# EAGLE design Skaarhoj BI8-2x4 (EAGLE 6.2)
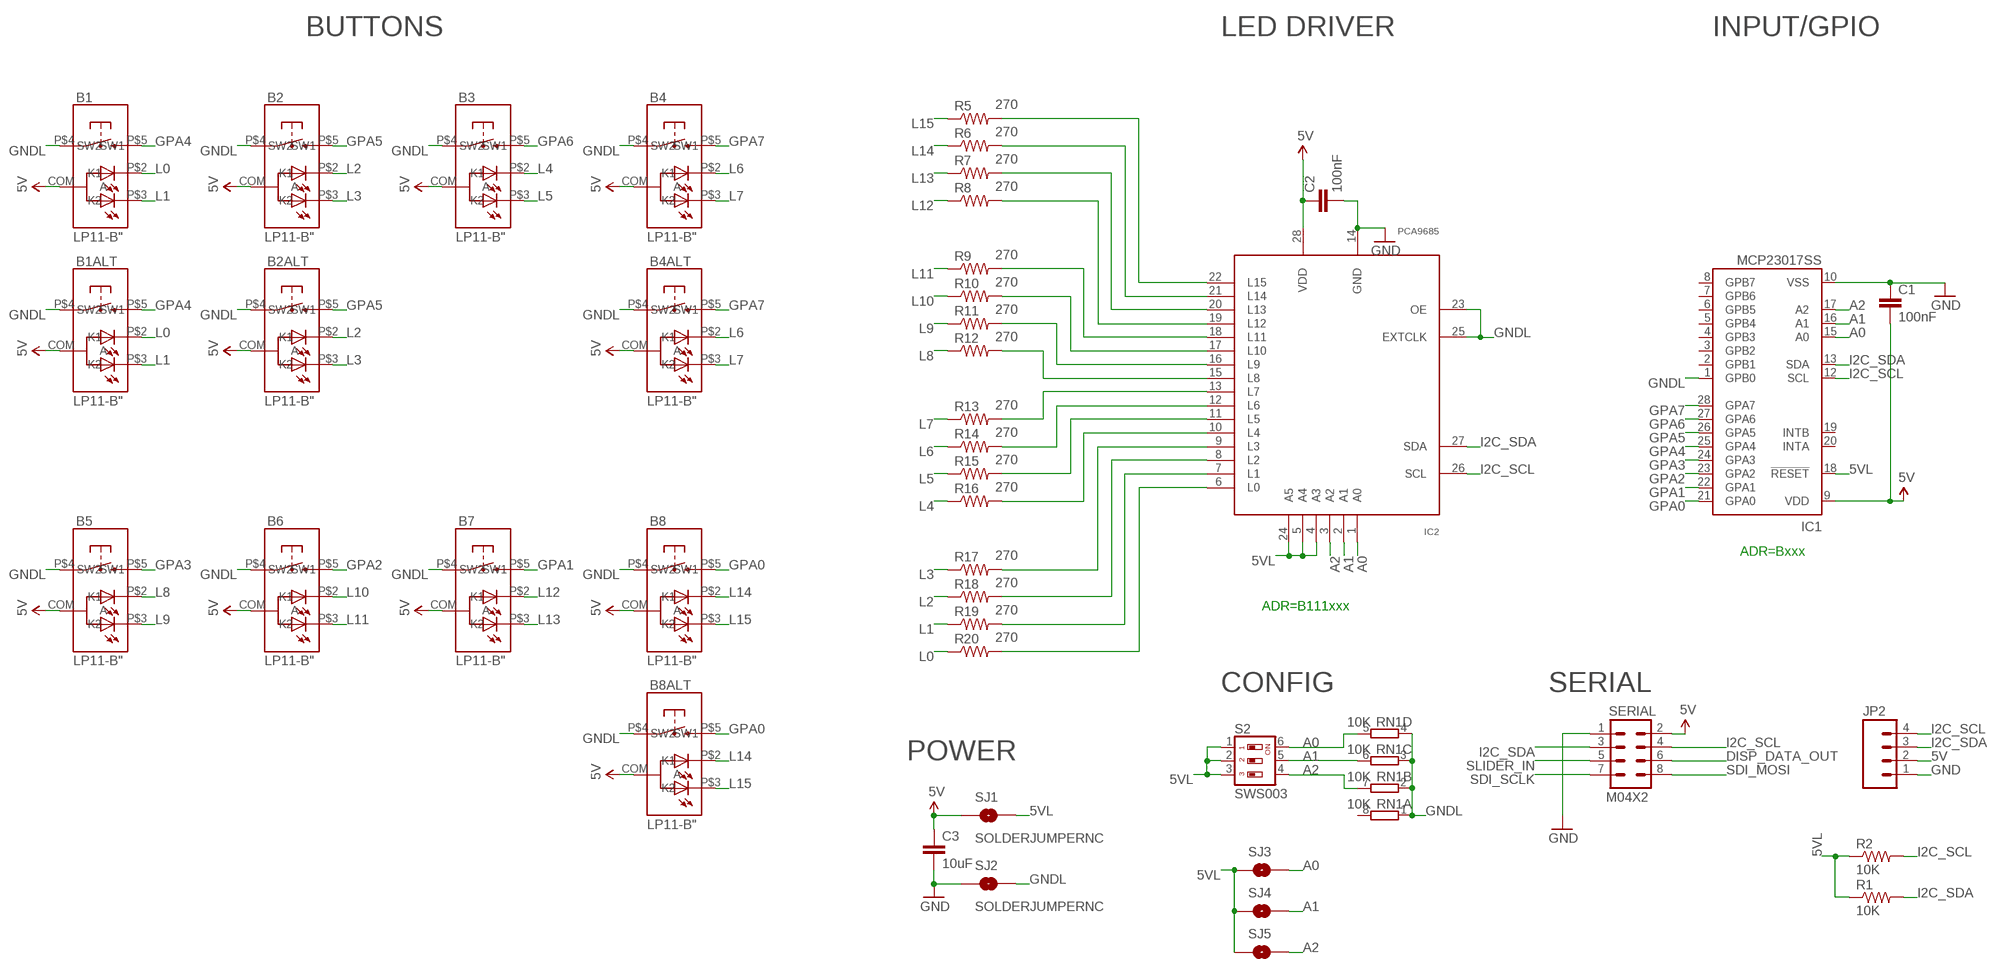
[diagram p0: schematic, sheet 1]

## Parts
B1  LP11-B"  [LP11]
B1ALT  LP11-B"  [LP11]
B2  LP11-B"  [LP11]
B2ALT  LP11-B"  [LP11]
B3  LP11-B"  [LP11]
B4  LP11-B"  [LP11]
B4ALT  LP11-B"  [LP11]
B5  LP11-B"  [LP11]
B6  LP11-B"  [LP11]
B7  LP11-B"  [LP11]
B8  LP11-B"  [LP11]
B8ALT  LP11-B"  [LP11]
C1  100nF  CAP0603-CAP  [0603-CAP]
C2  100nF  CAP0603-CAP  [0603-CAP]
C3  10uF  CAP0805  [0805]
IC1  MCP23017SS  [SSOP28]
IC2  PCA9685  [TSSOP28]
JP2  M04PTH  [1X04]
R1  10K  RESISTOR0603-RES  [0603-RES]
R2  10K  RESISTOR0603-RES  [0603-RES]
R5  270  RESISTOR0603-RES  [0603-RES]
R6  270  RESISTOR0603-RES  [0603-RES]
R7  270  RESISTOR0603-RES  [0603-RES]
R8  270  RESISTOR0603-RES  [0603-RES]
R9  270  RESISTOR0603-RES  [0603-RES]
R10  270  RESISTOR0603-RES  [0603-RES]
R11  270  RESISTOR0603-RES  [0603-RES]
R12  270  RESISTOR0603-RES  [0603-RES]
R13  270  RESISTOR0603-RES  [0603-RES]
R14  270  RESISTOR0603-RES  [0603-RES]
R15  270  RESISTOR0603-RES  [0603-RES]
R16  270  RESISTOR0603-RES  [0603-RES]
R17  270  RESISTOR0603-RES  [0603-RES]
R18  270  RESISTOR0603-RES  [0603-RES]
R19  270  RESISTOR0603-RES  [0603-RES]
R20  270  RESISTOR0603-RES  [0603-RES]
RN1  10K  4R-NCAY16  [CAY16_HAND]
S2  SWS003  [SMS-003]
SERIAL  M04X2  [2X4]
SJ1  SOLDERJUMPERNC  [SJ_2S]
SJ2  SOLDERJUMPERNC  [SJ_2S]
SJ3  SOLDERJUMPERNC  [SJ_2S]
SJ4  SOLDERJUMPERNC  [SJ_2S]
SJ5  SOLDERJUMPERNC  [SJ_2S]

## Nets
5V [Power]: B1.COM(A) B1ALT.COM(A) B2.COM(A) B2ALT.COM(A) B3.COM(A) B4.COM(A) B4ALT.COM(A) B5.COM(A) B6.COM(A) B7.COM(A) B8.COM(A) B8ALT.COM(A) C1.2 C2.1 C3.1 IC1.9(VDD) IC2.28(VDD) JP2.2 SERIAL.2 SJ1.1
5VL: IC1.18(!RESET) IC2.4(A3) IC2.5(A4) IC2.24(A5) R1.1 R2.1 S2.1 S2.2 S2.3 SJ1.2 SJ3.1 SJ4.1 SJ5.1
A0: IC1.15(A0) IC2.1(A0) RN1.5 S2.6 SJ3.2
A1: IC1.16(A1) IC2.2(A1) RN1.6 S2.5 SJ4.2
A2: IC1.17(A2) IC2.3(A2) RN1.7 S2.4 SJ5.2
DISP_DATA_OUT: SERIAL.6
GND [Power]: C1.1 C2.2 C3.2 IC1.10(VSS) IC2.14(GND) JP2.1 SERIAL.1 SJ2.1
GNDL: B1.P$4(SW1) B1ALT.P$4(SW1) B2.P$4(SW1) B2ALT.P$4(SW1) B3.P$4(SW1) B4.P$4(SW1) B4ALT.P$4(SW1) B5.P$4(SW1) B6.P$4(SW1) B7.P$4(SW1) B8.P$4(SW1) B8ALT.P$4(SW1) IC1.1(GPB0) IC2.23(OE) IC2.25(EXTCLK) RN1.1 RN1.2 RN1.3 RN1.4 SJ2.2
GPA0: B8.P$5(SW2) B8ALT.P$5(SW2) IC1.21(GPA0)
GPA1: B7.P$5(SW2) IC1.22(GPA1)
GPA2: B6.P$5(SW2) IC1.23(GPA2)
GPA3: B5.P$5(SW2) IC1.24(GPA3)
GPA4: B1.P$5(SW2) B1ALT.P$5(SW2) IC1.25(GPA4)
GPA5: B2.P$5(SW2) B2ALT.P$5(SW2) IC1.26(GPA5)
GPA6: B3.P$5(SW2) IC1.27(GPA6)
GPA7: B4.P$5(SW2) B4ALT.P$5(SW2) IC1.28(GPA7)
I2C_SCL: IC1.12(SCL) IC2.26(SCL) JP2.4 R2.2 SERIAL.4
I2C_SDA: IC1.13(SDA) IC2.27(SDA) JP2.3 R1.2 SERIAL.3
L0: B1.P$2(K1) B1ALT.P$2(K1) R20.1
L1: B1.P$3(K2) B1ALT.P$3(K2) R19.1
L2: B2.P$2(K1) B2ALT.P$2(K1) R18.1
L3: B2.P$3(K2) B2ALT.P$3(K2) R17.1
L4: B3.P$2(K1) R16.1
L5: B3.P$3(K2) R15.1
L6: B4.P$2(K1) B4ALT.P$2(K1) R14.1
L7: B4.P$3(K2) B4ALT.P$3(K2) R13.1
L8: B5.P$2(K1) R12.1
L9: B5.P$3(K2) R11.1
L10: B6.P$2(K1) R10.1
L11: B6.P$3(K2) R9.1
L12: B7.P$2(K1) R8.1
L13: B7.P$3(K2) R7.1
L14: B8.P$2(K1) B8ALT.P$2(K1) R6.1
L15: B8.P$3(K2) B8ALT.P$3(K2) R5.1
N$4: IC2.13(L7) R13.2
N$5: IC2.12(L6) R14.2
N$7: IC2.11(L5) R15.2
N$9: IC2.10(L4) R16.2
N$10: IC2.9(L3) R17.2
N$11: IC2.8(L2) R18.2
N$12: IC2.7(L1) R19.2
N$19: IC2.6(L0) R20.2
N$20: IC2.15(L8) R12.2
N$21: IC2.16(L9) R11.2
N$22: IC2.17(L10) R10.2
N$23: IC2.18(L11) R9.2
N$24: IC2.19(L12) R8.2
N$25: IC2.20(L13) R7.2
N$26: IC2.21(L14) R6.2
N$27: IC2.22(L15) R5.2
SDI_MOSI: SERIAL.8
SDI_SCLK: SERIAL.7
SLIDER_IN: SERIAL.5
Unconnected: IC1.2(GPB1) IC1.3(GPB2) IC1.4(GPB3) IC1.5(GPB4) IC1.6(GPB5) IC1.7(GPB6) IC1.8(GPB7) IC1.19(INTB) IC1.20(INTA) RN1.8

## Notes on the sheet
- BUTTONS | LED DRIVER | INPUT/GPIO
- ADR=Bxxx
- ADR=B111xxx
- CONFIG | SERIAL
- POWER

## Library data of the parts
B1 B1ALT B2 B2ALT B3 B4 B4ALT B5-B8 B8ALT = SKAARHOJ:LP11-B
C1-C3 = SparkFun:CAP: Capacitor Standard 0603 ceramic capacitor, and 0.1" leaded capacitor.
IC1 = microchip:MCP23017: http://ww1.microchip.com/downloads/en/DeviceDoc/21952a.pdf Source: http://ww1.microchip.com/downloads/en/DeviceDoc/21952a.pdf; MF: MICROCHIP; MPN: MCP23017-E/SS; OC_FARNELL: 1467674; OC_NEWARK: 31K2960
IC2 = wsmith:PCA9685
JP2 = SparkFun:M04: Header 4 Standard 4-pin 0.1" header. Use with straight break away headers (SKU : PRT-00116), right angle break away headers (PRT-00553), swiss pins (PRT-00743), machine pins (PRT-00117), and female headers (PRT-00115). Molex polarized connector foot print use with SKU : PRT-08231 with associated crimp pins and housings. 1MM SMD Version SKU: PRT-10208
R1 R2 R5-R20 = SparkFun:RESISTOR: Resistor Basic schematic elements and footprints for 0603, 1206, and PTH resistors.
RN1 = SKAARHOJ:4R-N: Array Chip Resistor Source: RS Component / Phycomp; OC_FARNELL: unknown; OC_NEWARK: unknown
S2 = smd-special:SWS003: SMD Dip Switch 3 pol.
SERIAL = SparkFun:M04X2
SJ1-SJ5 = SparkFun:SOLDERJUMPER: Solder Jumper Standard SMD solder jumper. Used to automate production. Two varients : Normally Open and Normally Closed are the same, but have different paste layers. NC will have a large amount of paste and should jumper during reflow.

## Net classes
0 default: width 0.203 mm, drill 0.406 mm, clearance 0.203 mm
1 Power: width 0.406 mm, drill 0.61 mm, clearance 0.203 mm

## Board
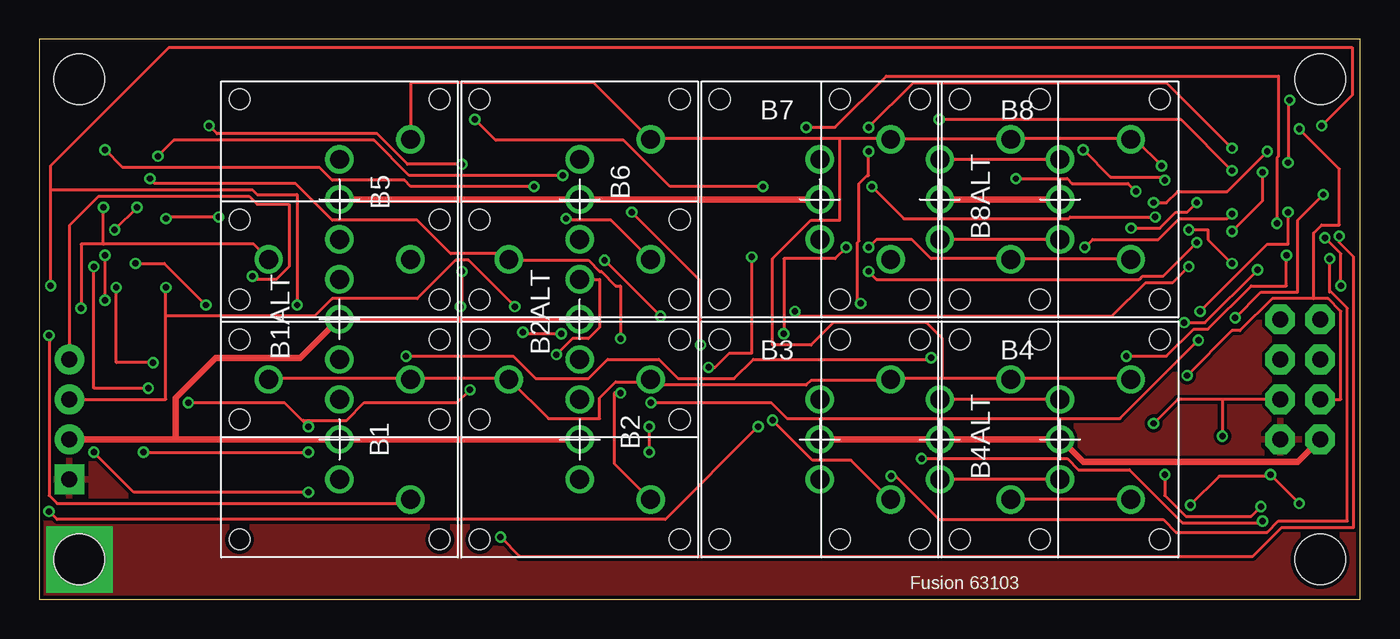
[diagram p1: board, top side]
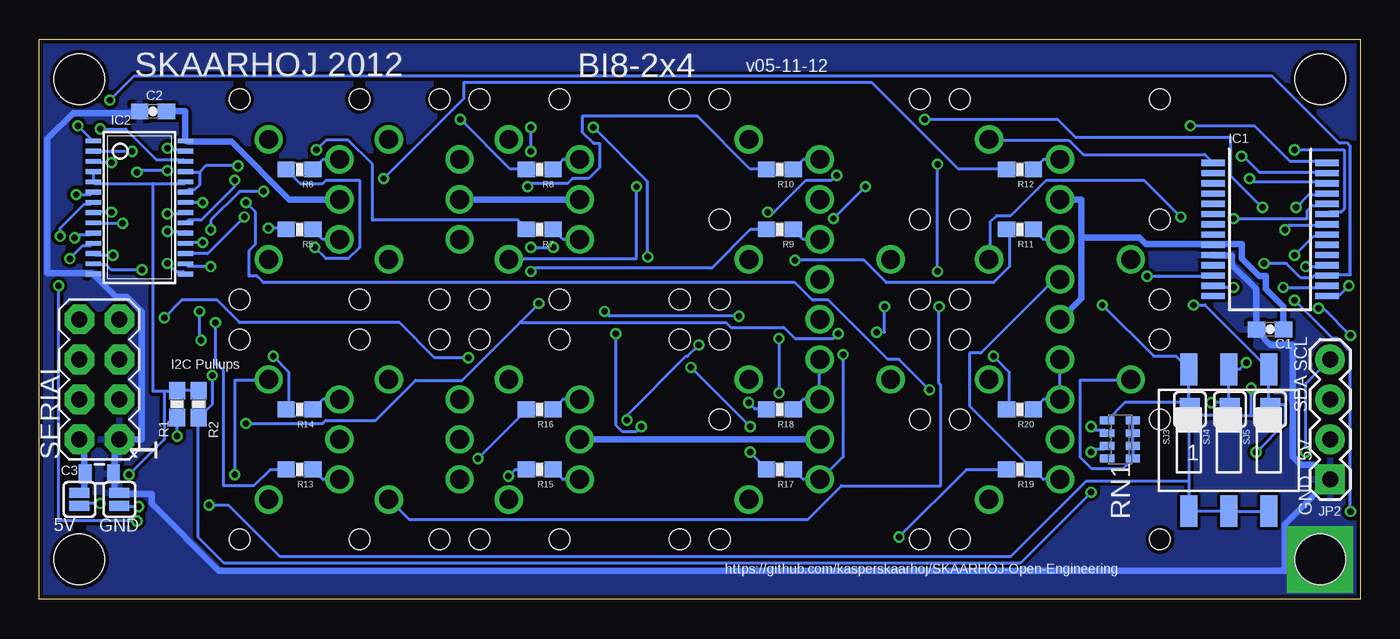
[diagram p2: board, bottom side, seen from below]

Size 83.82 x 35.56 mm. Coordinates in mm from the lower left corner, seen from the top.
Outline: 0,0 83.82,0 83.82,35.56 0,35.56 0,0
Copper layers (1*16): Top 0.035mm / dielectric 1.5mm / Bottom 0.035mm
Design rules: minimum track width 6mil, minimum drill 12mil, track to track 6mil, track to pad 6mil, pad to pad 6mil, via to via 6mil, smd to smd 0mil, copper to edge 10mil, drill to drill 10mil, minimum pad ring 10mil, minimum via ring 6mil, stop-mask expansion 2mil, vias tented up to drill 100mil, thermal gap 10mil
Holes 3.2 mm at 2.54,33.02 2.54,2.54 81.28,2.54 81.28,33.02

### Footprints (pad centres in the part's own frame; a part is rotated, then mirrored left to right if it is on the bottom)
LP11 = drill 1.2: COM 0,0; P$2 0,2.54; P$3 0,-2.54; P$4 4.5,3.81; P$5 4.5,-3.81 | hole 1.3: -6.35,6.35; 6.35,6.35; 6.35,-6.35; -6.35,-6.35
0603-CAP = smd 1.1 x 1: 1 -0.85,0; 2 0.85,0
0805 = smd 0.8 x 1.2: 1 -0.9,0; 2 0.9,0
SSOP28 = smd 0.4 x 1.5: 1 -4.225,-3.625; 2 -3.575,-3.625; 3 -2.925,-3.625; 4 -2.275,-3.625; 5 -1.625,-3.625; 6 -0.975,-3.625; 7 -0.325,-3.625; 8 0.325,-3.625; 9 0.975,-3.625; 10 1.625,-3.625; 11 2.275,-3.625; 12 2.925,-3.625; 13 3.575,-3.625; 14 4.225,-3.625; 15 4.225,3.625; 16 3.575,3.625; 17 2.925,3.625; 18 2.275,3.625; 19 1.625,3.625; 20 0.975,3.625; 21 0.325,3.625; 22 -0.325,3.625; 23 -0.975,3.625; 24 -1.625,3.625; 25 -2.275,3.625; 26 -2.925,3.625; 27 -3.575,3.625; 28 -4.225,3.625
TSSOP28 = smd 0.305 x 0.991: 1 -4.225,-2.918; 2 -3.575,-2.918; 3 -2.925,-2.918; 4 -2.275,-2.918; 5 -1.625,-2.918; 6 -0.975,-2.918; 7 -0.325,-2.918; 8 0.325,-2.918; 9 0.975,-2.918; 10 1.625,-2.918; 11 2.275,-2.918; 12 2.925,-2.918; 13 3.575,-2.918; 14 4.225,-2.918; 15 4.225,2.918; 16 3.575,2.918; 17 2.925,2.918; 18 2.275,2.918; 19 1.625,2.918; 20 0.975,2.918; 21 0.325,2.918; 22 -0.325,2.918; 23 -0.975,2.918; 24 -1.625,2.918; 25 -2.275,2.918; 26 -2.925,2.918; 27 -3.575,2.918; 28 -4.225,2.918
1X04 = drill 1.016 pad 1.88 square: 1 0,0 | drill 1.016 pad 1.88: 2 2.54,0; 3 5.08,0; 4 7.62,0
0603-RES = smd 1.1 x 1: 1 -0.85,0; 2 0.85,0
CAY16_HAND = smd 0.5 x 0.904: 1 -1.2,-0.813; 2 -0.4,-0.813; 3 0.4,-0.813; 4 1.2,-0.813; 5 1.2,0.813; 6 0.4,0.813; 7 -0.4,0.813; 8 -1.2,0.813
SMS-003 = smd 1.092 x 2.007: 1 -2.54,-4.496; 2 0,-4.496; 3 2.54,-4.496; 4 2.54,4.496; 5 0,4.496; 6 -2.54,4.496
2X4 = drill 1.016 pad 1.88 octagon: 1 -3.81,-1.27; 2 -3.81,1.27; 3 -1.27,-1.27; 4 -1.27,1.27; 5 1.27,-1.27; 6 1.27,1.27; 7 3.81,-1.27; 8 3.81,1.27
SJ_2S = smd 0.635 x 1.27: 1 -0.412,0; 2 0.412,0

### Placement (x,y rotation side)
B1  19.05,10.16 0 top
B1ALT  19.05,17.78 180 top
B2  34.29,10.16 0 top
B2ALT  34.29,17.78 180 top
B3  49.53,10.16 0 top
B4  64.77,10.16 0 top
B4ALT  57.15,10.16 0 top
B5  19.05,25.4 0 top
B6  34.29,25.4 0 top
B7  49.53,25.4 0 top
B8  64.77,25.4 0 top
B8ALT  57.15,25.4 0 top
C1  5.71,17.14 0 bottom
C2  76.61,30.99 180 bottom
C3  80.01,7.98 0 bottom
IC1  5.71,23.5 270 bottom
IC2  77.47,24.89 270 bottom
JP2  1.91,7.62 90 bottom
R1  75.08,12.4 270 bottom
R2  73.71,12.4 270 bottom
R5  67.31,23.5 180 bottom
R6  67.31,27.3 180 bottom
R7  52.07,23.5 180 bottom
R8  52.07,27.3 180 bottom
R9  36.83,23.5 180 bottom
R10  36.83,27.3 180 bottom
R11  21.59,23.5 180 bottom
R12  21.59,27.3 180 bottom
R13  67.31,8.26 180 bottom
R14  67.31,12.06 180 bottom
R15  52.07,8.26 180 bottom
R16  52.07,12.06 180 bottom
R17  36.83,8.26 180 bottom
R18  36.83,12.06 180 bottom
R19  21.59,8.26 180 bottom
R20  21.59,12.06 180 bottom
RN1  15.24,10.16 90 bottom
S2  8.33,10.11 0 bottom
SERIAL  80.01,13.97 90 bottom
SJ1  81.28,6.35 270 bottom
SJ2  78.74,6.35 270 bottom
SJ3  10.79,12.06 90 bottom
SJ4  8.26,12.06 90 bottom
SJ5  5.71,12.06 90 bottom

### Tracks (layer width: path | path; a pad name or v marks a point on that pad's centre or on a via)
5V
  Top 0.406: B2ALT.COM B1ALT.COM 18.9,17.68 16.56,15.34 11.18,15.34 8.64,12.8 8.64,10.16 | B7.COM B6.COM B5.COM | B8.COM B8ALT.COM | B2.COM B1.COM 8.64,10.16 | 8.64,10.16 JP2.2 | B3.COM B4ALT.COM B4.COM 64.92,10.06 66.24,8.74 79.86,8.74 SERIAL.2
  Bottom 0.406: C1.2 4.88,17.17 4.88,18.59 5.99,19.71 5.99,20.52 6.4,20.52 7.52,21.64 7.52,22.55 9.25,22.55 IC1.9 9.45,22.55 13.61,22.55 14.02,22.96 17.68,22.96 | 17.68,22.96 17.68,25.4 B5.COM | 17.68,22.96 17.68,19.1 19,17.78 B1ALT.COM | C2.1 74.57,30.99 74.57,29.16 IC2.28 74.37,29.06 71.63,29.06 67.97,25.4 B8.COM | B8ALT.COM B7.COM | SJ1.1 81.28,6.81 80.97,6.81 80.97,7.92 C3.1 80.97,8.13 80.97,10.16 SERIAL.2 | B3.COM B2.COM
5VL  (via drill 0.41)
  Top 0.203: v3.45,21.13 3.45,13.41 v6.91,13.41 | v79.96,6.1 v78.13,7.92 78.13,7.82 74.88,7.82 v73.05,5.99
  Bottom 0.203: 8.33,5.59 5.79,5.59 S2.3 | 8.33,5.59 10.87,5.59 S2.1 10.87,7.52 | 8.33,5.59 S2.2 | 6.91,11.68 8.23,11.68 SJ4.1 8.33,11.68 10.77,11.68 SJ3.1 10.87,11.58 10.87,7.52 | 6.91,11.68 5.79,11.68 SJ5.1 | v3.45,21.13 2.13,21.13 IC1.18 | 6.91,11.68 v6.91,13.41 | 76.61,26.42 80.37,26.42 IC2.5 80.37,26.62 80.37,27.13 IC2.4 | 76.61,26.42 74.57,26.42 IC2.24 | R2.1 73.76,13.31 75.08,13.31 R1.1 75.08,13.21 75.89,13.21 | v79.96,6.1 81.18,6.1 81.28,5.99 SJ1.2 | v78.13,7.92 75.89,10.16 75.89,13.21 | 76.61,26.42 76.61,13.21 75.89,13.21 | 10.87,7.52 17.37,7.52 22.15,2.74 68.58,2.74 71.83,5.99 v73.05,5.99
A0  (via drill 0.41)
  Top 0.203: v81.38,30.07 83.31,32 83.31,35.05 8.23,35.05 0.71,27.53 0.71,26.01 | v0.71,19.91 0.71,26.01 | v16.36,18.69 16.36,25.7 13.82,25.7 13.51,26.01 0.71,26.01
  Bottom 0.203: RN1.5 16.05,11.38 14.94,12.5 10.87,12.5 SJ3.2 10.87,12.6 S2.6 10.87,14.63 11.68,15.44 13.11,15.44 v16.36,18.69 | v81.38,30.07 80.47,29.16 IC2.1 | v0.71,19.91 1.32,19.3 2.03,19.3 IC1.15
A1  (via drill 0.41)
  Top 0.203: v4.88,19.81 4.88,15.04 v7.21,15.04 | 16.71,11.33 15.54,12.5 v9.45,12.5 | 16.71,11.33 v17.07,10.97 | v77.93,28.45 75.39,25.91 72.24,25.91 71.53,25.2 v70.71,25.2 | v27.33,13.31 26.52,12.5 20.62,12.5 19.51,11.38 16.76,11.38 16.71,11.33
  Bottom 0.203: v4.88,19.81 2.23,19.81 2.13,19.91 IC1.16 | v7.21,15.04 7.62,14.63 8.33,14.63 S2.5 8.33,12.6 SJ4.2 8.33,12.5 v9.45,12.5 | v17.07,10.97 16.87,10.77 16.26,10.77 RN1.6 | v77.93,28.45 80.37,28.45 IC2.2 | v70.71,25.2 70.1,24.59 70.1,22.55 70.51,22.15 70.51,20.52 70,20.52 69.6,20.12 35.87,20.12 34.75,19 33.73,19 29.97,15.24 29.26,15.24 v27.33,13.31
A2  (via drill 0.41)
  Top 0.203: v6.6,9.35 v17.07,9.35 | v79.25,27.74 79.25,31.7 v79.35,31.7 | v10.57,18.69 7.92,21.34 v6.1,21.34
  Bottom 0.203: v17.07,9.35 16.87,9.55 16.26,9.55 RN1.7 | v6.6,9.35 4.78,11.18 4.78,12.39 5.69,12.39 SJ5.2 5.79,12.5 S2.4 5.79,14.63 9.86,18.69 v10.57,18.69 | v79.25,27.74 80.37,27.74 IC2.3 | v79.35,31.7 77.83,33.22 5.59,33.22 1.32,28.96 0.81,28.96 0.61,28.75 0.61,20.62 2.03,20.62 IC1.17 2.13,20.52 2.95,20.52 3.05,20.42 3.76,20.42 4.67,21.34 v6.1,21.34
GND  (via drill 3.2)
  Bottom 0.406: IC1.10 9.25,21.84 8.13,21.84 8.13,21.23 6.6,19.71 6.6,17.17 C1.1 6.5,16.97 5.69,16.15 4.27,16.15 4.27,9.04 3.76,8.53 2.85,8.53 1.93,7.62 JP2.1 2.03,7.52 4.78,4.78 4.78,1.83 | C2.2 77.52,30.99 77.62,30.89 81.69,30.89 83.31,29.26 83.31,20.73 80.57,20.73 IC2.14 80.37,20.62 78.94,19.2 78.23,19.2 77.32,18.29 77.32,10.16 SERIAL.1 78.84,10.06 79.05,10.06 79.05,8.13 C3.2 79.05,7.92 79.05,6.81 78.74,6.81 SJ2.1 78.64,6.71 76.71,6.71 76.71,6.1 72.44,1.83 4.78,1.83 | 4.78,1.83 2.54,1.83 v2.54,2.54
  pour Top: 0,0 83.82,0 83.82,35.56 0,35.56
  pour Bottom: 0,0 83.82,0 83.82,35.56 0,35.56
GNDL  (via drill 0.41)
  Top 0.203: v71.22,27.53 69.6,29.16 69.29,29.16 B8.P$4 69.19,29.26 61.67,29.26 B8ALT.P$4 61.57,29.26 54.05,29.26 B7.P$4 53.95,29.26 50.8,29.26 | 50.8,29.26 38.81,29.26 B6.P$4 38.71,29.26 35.15,32.82 23.57,32.82 23.57,29.26 B5.P$4 | B1ALT.P$4 14.63,14.02 23.47,14.02 B1.P$4 23.57,14.02 29.77,14.02 B2ALT.P$4 29.87,13.92 32.31,11.48 35.56,11.48 35.56,12.8 36.58,13.82 38.61,13.82 38.71,13.92 B2.P$4 38.81,13.92 39.12,13.61 48.67,13.61 48.97,13.92 53.95,13.92 B3.P$4 54.05,14.02 57.3,14.02 | 57.3,14.02 61.57,14.02 B4ALT.P$4 61.67,14.02 69.19,14.02 B4.P$4 | v77.52,5.89 76.91,5.28 72.75,5.28 71.42,6.6 v71.42,7.92 | 50.8,29.26 50.8,24.08 48.97,24.08 46.53,21.64 46.53,16.15 48.97,16.15 50.39,17.58 56.29,17.58 57.3,16.56 57.3,14.02
  Bottom 0.203: IC1.1 9.35,27.74 9.86,28.25 17.58,28.25 18.49,29.16 23.47,29.16 B5.P$4 | 73.66,27.13 73.66,26.31 73.97,26.01 74.37,26.01 74.47,25.91 IC2.23 | 73.66,27.13 74.47,27.13 IC2.25 | 73.66,27.13 73.25,27.53 v71.22,27.53 | RN1.4 RN1.3 RN1.2 RN1.1 14.43,8.94 15.04,8.33 17.07,8.33 17.78,9.04 17.78,13.92 14.63,13.92 B1ALT.P$4 | v77.52,5.89 78.74,5.89 SJ2.2 | v71.42,7.92 71.42,13.92 69.29,13.92 B4.P$4
GPA0  (via drill 0.41)
  Top 0.203: v4.17,19 v4.17,21.84 | v0.61,5.59 1.12,5.08 39.73,5.08 v45.62,10.97 | v47.24,16.87 47.24,21.64 50.49,21.64 v51.21,22.35 | v52.63,22.35 53.14,22.86 55.37,22.86 56.59,21.64 61.57,21.64 B8ALT.P$5 61.67,21.64 69.19,21.64 B8.P$5
  Bottom 0.203: v4.17,21.84 2.95,23.06 2.23,23.06 2.13,23.16 IC1.21 | v4.17,19 1.73,16.56 1.42,16.56 0.61,15.75 v0.61,5.59 | v45.62,10.97 45.92,10.67 46.84,10.67 47.24,11.07 v47.24,16.87 | v52.63,22.35 v51.21,22.35
GPA1  (via drill 0.41)
  Top 0.203: v6.2,24.89 v4.78,23.47 | v27.64,30.48 28.96,29.16 37.08,29.16 40.03,26.21 v45.92,26.21
  Bottom 0.203: v4.78,23.47 4.47,23.77 2.13,23.77 IC1.22 | v6.2,24.89 8.23,26.92 8.23,29.36 18.09,29.36 19.2,30.48 v27.64,30.48 | v45.92,26.21 45.92,21.64 53.95,21.64 B7.P$5
GPA2  (via drill 0.41)
  Top 0.203: v4.17,28.55 5.28,27.43 17.78,27.43 18.59,26.62 23.16,26.62 23.57,26.21 v31.39,26.21 | v33.43,24.18 33.53,24.08 36.27,24.08 38.71,21.64 B6.P$5
  Bottom 0.203: v4.17,28.55 1.02,28.55 1.02,24.79 1.22,24.59 1.93,24.59 2.03,24.49 IC1.23 | v33.43,24.18 v31.39,26.21
GPA3  (via drill 0.41)
  Top 0.203: v8.03,24.18 8.13,24.28 v11.38,24.28
  Bottom 0.203: v8.03,24.18 3.35,24.18 3.35,24.69 3.05,24.99 2.23,24.99 2.13,25.09 IC1.24 | v11.38,24.28 13.72,26.62 19.91,26.62 22.15,24.38 23.06,24.38 23.47,23.98 23.47,21.64 B5.P$5
GPA4  (via drill 0.41)
  Top 0.203: 4.06,22.55 v4.06,24.89 | 4.06,22.55 13.61,22.55 14.53,21.64 B1ALT.P$5 | v0.61,16.76 0.61,6.6 1.12,6.1 23.27,6.1 23.47,6.3 B1.P$5 | v2.64,18.49 2.64,22.55 4.06,22.55
  Bottom 0.203: v4.06,24.89 3.25,25.7 2.13,25.7 IC1.25 | v0.61,16.76 2.34,18.49 v2.64,18.49
GPA5  (via drill 0.41)
  Top 0.203: v7.01,26.72 7.32,26.42 16.26,26.42 18.59,24.08 23.98,24.08 26.11,21.95 29.46,21.95 29.77,21.64 B2ALT.P$5 29.87,21.54 34.85,21.54 35.56,20.83 35.66,20.83 36.58,19.91 36.88,19.91 v36.88,16.56 | v36.88,13.11 36.47,13.11 36.47,8.64 38.71,6.4 B2.P$5
  Bottom 0.203: v7.01,26.72 6.81,26.52 2.13,26.52 IC1.26 | v36.88,16.56 v36.88,13.11
GPA6  (via drill 0.41)
  Top 0.203: v7.52,28.14 8.53,29.16 21.23,29.16 23.47,26.92 v33.22,26.92 | v37.59,24.59 41.96,20.22 v41.96,16.15 | v46.53,11.38 49.07,8.84 51.51,8.84 53.95,6.4 B3.P$5
  Bottom 0.203: v7.52,28.14 7.42,28.14 6.4,27.13 2.13,27.13 IC1.27 | v33.22,26.92 33.53,26.62 35.15,26.62 37.19,24.59 v37.59,24.59 | v41.96,16.15 42.67,15.44 42.77,15.44 46.53,11.68 v46.53,11.38
GPA7  (via drill 0.41)
  Top 0.203: v10.77,30.07 11.28,29.57 21.44,29.57 23.37,27.64 v26.82,27.64 | v26.82,20.83 26.82,18.59 v26.72,18.59 | B4.P$5 69.19,6.4 61.67,6.4 B4ALT.P$5
  Bottom 0.203: v10.77,30.07 6.71,30.07 4.47,27.84 2.23,27.84 2.13,27.74 IC1.28 | v26.82,20.83 v26.82,27.64 | v26.72,18.59 26.72,13.72 26.62,13.61 26.62,7.21 32.92,7.21 35.05,5.08 60.35,5.08 61.57,6.3 B4ALT.P$5
I2C_SCL  (via drill 0.41)
  Top 0.203: v13.51,20.52 13.72,20.32 15.04,20.32 15.85,21.13 15.85,25.09 13.82,25.09 13.31,25.6 3.76,25.6 1.93,23.77 1.93,15.24 JP2.4 | v79.96,29.87 82.5,27.33 82.5,23.77 81.38,23.77 80.87,23.27 80.87,19.1 | 80.87,19.1 81.79,19.1 82.6,18.29 82.6,12.7 SERIAL.4 | v72.85,14.22 75.69,17.07 76.2,17.07 78.23,19.1 80.87,19.1 | v3.45,9.35 5.99,6.81 v17.07,6.81
  Bottom 0.203: v13.51,20.52 9.35,20.52 IC1.12 | v79.96,29.87 78.33,29.87 76.4,27.94 74.68,27.94 74.57,27.84 IC2.26 | v72.85,14.22 72.85,12.39 73.66,11.58 R2.2 73.76,11.48 73.76,3.96 72.14,2.34 21.54,2.34 v17.07,6.81 | v3.45,9.35 3.45,13.72 1.93,15.24 JP2.4
I2C_SDA  (via drill 0.41)
  Top 0.203: 8.03,17.98 8.03,12.7 JP2.3 | 8.03,17.98 v8.03,19.81 | v75.69,28.65 71.53,32.82 55.47,32.82 v52.63,29.97 | v52.63,28.45 52.63,26.92 52.53,26.92 52.02,26.42 52.02,22.76 51.92,22.66 51.92,18.8 v52.12,18.8 | v70.71,11.18 72.24,12.7 75.08,12.7 | SERIAL.3 75.08,12.7 | 75.08,12.7 v75.08,10.36 | 8.03,17.98 17.48,17.98 18.59,19.1 23.98,19.1 26.42,21.54 27.23,21.54 v30.18,18.59 | v30.68,16.97 30.79,16.87 v33.12,16.87
  Bottom 0.203: v8.03,19.81 9.14,19.81 9.25,19.91 IC1.13 | v75.69,28.65 75.59,28.55 74.57,28.55 IC2.27 | v52.63,28.45 v52.63,29.97 | 53.29,17.63 57,13.92 59.94,13.92 62.48,11.38 65.63,11.38 65.84,11.18 v70.71,11.18 | 53.29,17.63 v52.12,18.8 | v75.08,10.36 R1.2 | v30.18,18.59 30.18,16.97 v30.68,16.97 | v33.12,16.87 33.43,16.56 35.87,16.56 36.58,17.27 39.93,17.27 40.23,17.58 53.24,17.58 53.29,17.63
L0
  Bottom 0.203: 19.1,12.7 20.12,12.7 20.73,12.09 R20.1 | 19.1,12.7 19.1,15.24 B1ALT.P$2 | 19.1,12.7 B1.P$2
L1
  Bottom 0.203: B1.P$3 20.12,7.62 20.73,8.23 R19.1 20.83,8.33 24.79,12.29 24.79,15.65 24.08,15.65 19.41,20.32 B1ALT.P$3
L2
  Bottom 0.203: 34.34,12.7 35.36,12.7 35.97,12.09 R18.1 | 34.34,12.7 34.34,15.24 B2ALT.P$2 | 34.34,12.7 B2.P$2
L3  (via drill 0.41)
  Top 0.203: v32.82,15.54 33.83,16.56 34.85,16.56 35.56,17.27 35.56,20.32 B2ALT.P$3
  Bottom 0.203: R17.1 35.97,8.23 35.36,7.62 B2.P$3 34.24,7.62 32.82,9.04 v32.82,15.54
L4
  Bottom 0.203: B3.P$2 50.6,12.7 51.21,12.09 R16.1
L5
  Bottom 0.203: B3.P$3 50.6,7.62 51.21,8.23 R15.1
L6
  Top 0.203: B4.P$2 B4ALT.P$2
  Bottom 0.203: B4.P$2 65.84,12.7 66.45,12.09 R14.1
L7
  Top 0.203: B4.P$3 B4ALT.P$3
  Bottom 0.203: B4.P$3 65.84,7.62 66.45,8.23 R13.1
L8
  Bottom 0.203: B5.P$2 20.12,27.94 20.73,27.33 R12.1
L9
  Bottom 0.203: B5.P$3 20.12,22.86 20.73,23.47 R11.1
L10
  Bottom 0.203: B6.P$2 35.36,27.94 35.97,27.33 R10.1
L11
  Bottom 0.203: B6.P$3 35.36,22.86 35.97,23.47 R9.1
L12
  Bottom 0.203: B7.P$2 50.6,27.94 51.21,27.33 R8.1
L13
  Bottom 0.203: B7.P$3 50.6,22.86 51.21,23.47 R7.1
L14
  Top 0.203: B8.P$2 B8ALT.P$2
  Bottom 0.203: B8.P$2 65.84,27.94 66.45,27.33 R6.1
L15
  Top 0.203: B8.P$3 B8ALT.P$3
  Bottom 0.203: B8.P$3 65.84,22.86 66.45,23.47 R5.1
N$4  (via drill 0.41)
  Top 0.203: v77.32,20.93 73.97,17.58 v72.64,17.58
  Bottom 0.203: v77.32,20.93 79.25,20.93 79.55,21.23 80.37,21.23 IC2.13 | v72.64,17.58 72.64,14.94 72.54,14.94 72.14,14.53 72.14,7.21 70.21,7.21 69.19,8.23 68.17,8.23 R13.2
N$5  (via drill 0.41)
  Top 0.203: v79.15,21.84 79.15,19.91 76.91,19.91 74.17,17.17 73.25,17.17 71.53,15.44 v68.99,15.44
  Bottom 0.203: v79.15,21.84 80.26,21.84 80.37,21.95 IC2.12 | v68.99,15.44 67.97,14.43 67.97,12.09 68.07,12.09 R14.2
N$7  (via drill 0.41)
  Top 0.203: v81.89,21.64 81.89,19.51 81.99,19.51 83.01,18.49 83.01,4.98 78.64,4.98 77.93,4.27 72.14,4.27 71.32,5.08 57.1,5.08 54.36,7.82 v54.05,7.82
  Bottom 0.203: v81.89,21.64 81.08,22.45 80.57,22.45 80.47,22.55 IC2.11 | v54.05,7.82 53.65,8.23 52.93,8.23 R15.2
N$9  (via drill 0.41)
  Top 0.203: v81.58,22.96 82.6,21.95 v82.6,19.91 | v77.62,4.98 77.52,4.88 72.54,4.88 69.19,8.23 65.94,8.23 65.23,8.94 v55.98,8.94
  Bottom 0.203: v81.58,22.96 81.38,23.16 80.57,23.16 80.47,23.27 IC2.10 | v82.6,19.91 82.6,4.98 v77.62,4.98 | v55.98,8.94 52.93,11.99 R16.2
N$10  (via drill 0.41)
  Top 0.203: v78.54,23.88 78.54,28.04 78.64,28.14 78.64,33.22 53.75,33.22 50.49,29.97 v48.67,29.97 | v45.21,21.74 45.21,15.65 43.79,15.65 42.88,14.73 v42.47,14.73 | v38.71,9.35 v38.71,10.97
  Bottom 0.203: v78.54,23.88 80.37,23.88 IC2.9 | v48.67,29.97 45.21,26.52 v45.21,21.74 | v38.71,10.97 v42.47,14.73 | v38.71,9.35 37.69,8.33 R17.2
N$11  (via drill 0.41)
  Top 0.203: v79.25,24.59 79.25,22.55 77.93,22.55 v73.66,18.29 | v73.56,16.46 68.58,11.48 47.45,11.48 46.43,12.5 v38.81,12.5
  Bottom 0.203: v79.25,24.59 80.37,24.59 IC2.8 | v73.66,18.29 73.66,16.46 v73.56,16.46 | v38.81,12.5 38.41,12.09 37.69,12.09 R18.2
N$12  (via drill 0.41)
  Top 0.203: v82.5,23.06 82.5,22.66 83.41,21.74 83.41,4.57 78.84,4.57 77.01,2.74 30.48,2.74 v29.26,3.96
  Bottom 0.203: v82.5,23.06 82.5,23.57 80.97,25.09 80.57,25.09 80.47,25.2 IC2.7 | v29.26,3.96 24.99,8.23 22.45,8.23 R19.2
N$19  (via drill 0.41)
  Top 0.203: v81.48,25.7 79.86,24.08 79.86,19.51 77.52,19.51 v75.89,17.88 | v56.59,15.34 56.49,15.24 45.31,15.24 44.09,14.02 40.54,14.02 39.32,15.24 36.07,15.24 34.85,14.02 31.5,14.02 30.07,15.44 v23.27,15.44
  Bottom 0.203: v81.48,25.7 80.57,25.7 80.47,25.81 IC2.6 | v75.89,17.88 74.78,19 72.54,19 71.12,17.58 60.96,17.58 58.73,15.34 v56.59,15.34 | v23.27,15.44 22.25,14.43 22.25,12.09 22.35,12.09 R20.2
N$20  (via drill 0.41)
  Top 0.203: v75.69,21.34 74.17,22.86 74.17,23.47 v72.95,23.47 | v69.6,25.91 69.09,26.42 65.53,26.42 65.23,26.72 v61.98,26.72
  Bottom 0.203: v75.69,21.34 75.18,20.83 74.68,20.83 74.57,20.73 IC2.15 | v72.95,23.47 72.95,24.08 71.12,25.91 v69.6,25.91 | v61.98,26.72 56.9,31.8 56.9,32.82 30.99,32.82 25.5,27.33 22.45,27.33 R12.2
N$21  (via drill 0.41)
  Top 0.203: v72.95,21.13 71.93,20.12 70.21,20.12 68.07,17.98 48.26,17.98 v47.95,18.29 | v35.87,21.54 v39.42,17.98
  Bottom 0.203: v72.95,21.13 74.37,21.13 74.47,21.23 IC2.16 | v47.95,18.29 47.65,17.98 v39.42,17.98 | v35.87,21.54 31.5,21.54 30.07,20.12 23.27,20.12 22.25,21.13 22.25,23.47 22.35,23.47 R11.2
N$22  (via drill 0.41)
  Top 0.203: v70.81,24.28 65.43,24.28 65.33,24.18 54.86,24.18 v52.83,26.21
  Bottom 0.203: v70.81,24.28 73.15,21.95 74.47,21.95 IC2.17 | v52.83,26.21 52.63,26.42 50.29,26.42 49.99,26.72 48.97,26.72 48.26,27.43 48.26,28.96 48.67,28.96 49.38,29.67 49.38,30.68 42.06,30.68 38.71,27.33 37.69,27.33 R10.2
N$23  (via drill 0.41)
  Top 0.203: v73.46,22.66 71.32,20.52 70,20.52 69.8,20.32 53.14,20.32 v52.63,20.83
  Bottom 0.203: v73.46,22.66 74.47,22.66 IC2.18 | v52.63,20.83 52.43,21.03 41.15,21.03 38.71,23.47 37.69,23.47 R9.2
N$24  (via drill 0.41)
  Top 0.203: v75.69,23.37 77.62,25.3 v77.62,27.13 | v75.69,27.23 72.44,30.48 v57.1,30.48
  Bottom 0.203: v75.69,23.37 74.57,23.37 IC2.19 | v77.62,27.13 77.52,27.23 v75.69,27.23 | v57.1,30.48 53.95,27.33 52.93,27.33 R8.2
N$25  (via drill 0.41)
  Top 0.203: v71.42,26.62 71.22,26.82 67.97,26.82 v66.24,28.55
  Bottom 0.203: v71.42,26.62 71.42,26.21 73.56,24.08 74.37,24.08 74.47,23.98 IC2.20 | v66.24,28.55 65.63,29.16 64.21,29.16 62.69,27.64 62.69,24.08 53.44,24.08 52.93,23.57 R7.2
N$26  (via drill 0.41)
  Top 0.203: v75.69,24.49 75.39,24.18 72.34,24.18 71.02,22.86 66.85,22.86 v66.34,22.35
  Bottom 0.203: v75.69,24.49 74.57,24.49 IC2.21 | v66.34,22.35 65.63,21.64 64.21,21.64 63.5,22.35 63.5,26.62 65.63,26.62 65.84,26.42 67.26,26.42 68.07,27.23 R6.2
N$27  (via drill 0.41)
  Top 0.203: v73.46,25.2 72.85,24.59 72.14,24.59 71.12,23.57 v69.29,23.57
  Bottom 0.203: v73.46,25.2 74.47,25.2 IC2.22 | v69.29,23.57 68.17,23.57 R5.2

### Text on the board
_tsilk: Fusion 63103
_bsilk: v05-11-12 | BI8-2x4 | SKAARHOJ 2012 | I2C Pullups | SCL | SDA | 1 | 5V | GND | GND | 5V | https://github.com/kasperskaarhoj/SKAARHOJ-Open-Engineering